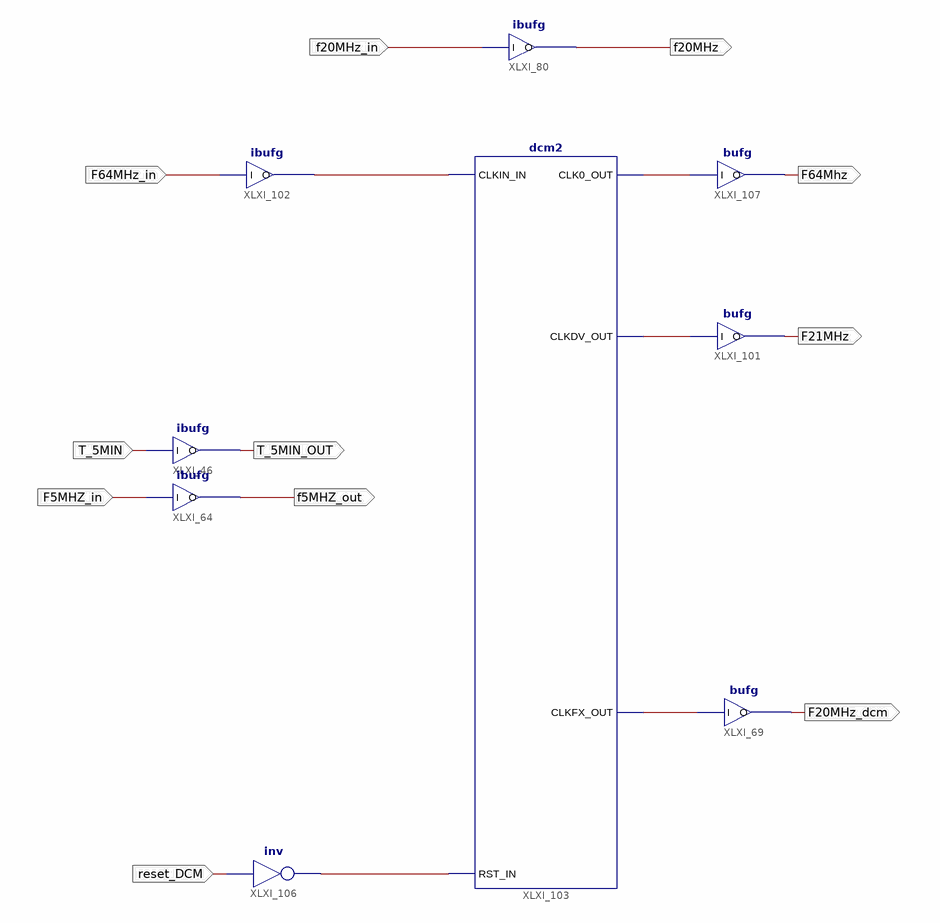
[diagram p0: schematic sheet 1]
// Xilinx ISE schematic clk_dcm_blok.sch (spartan3e) as structural Verilog: 9 symbols, 11 ports
module clk_dcm_blok (
  input  T_5MIN,
  input  F5MHZ_in,
  input  F64MHz_in,
  input  reset_DCM,
  input  f20MHz_in,
  output T_5MIN_OUT,
  output f5MHZ_out,
  output F21MHz,
  output F20MHz_dcm,
  output f20MHz,
  output F64Mhz
);

  wire INVF64MHz, XLXN_160, XLXN_178, XLXN_182, XLXN_183;

  ibufg XLXI_46 (.I(T_5MIN), .O(T_5MIN_OUT));
  ibufg XLXI_64 (.I(F5MHZ_in), .O(f5MHZ_out));
  bufg XLXI_101 (.I(XLXN_160), .O(F21MHz));
  bufg XLXI_69 (.I(XLXN_178), .O(F20MHz_dcm));
  ibufg XLXI_102 (.I(F64MHz_in), .O(INVF64MHz));
  dcm2 XLXI_103 (
    .CLKIN_IN(INVF64MHz), .RST_IN(XLXN_182), .CLKDV_OUT(XLXN_160), .CLKFX_OUT(XLXN_178), .CLK0_OUT(XLXN_183));
  not XLXI_106 (XLXN_182, reset_DCM);
  ibufg XLXI_80 (.I(f20MHz_in), .O(f20MHz));
  bufg XLXI_107 (.I(XLXN_183), .O(F64Mhz));
endmodule
